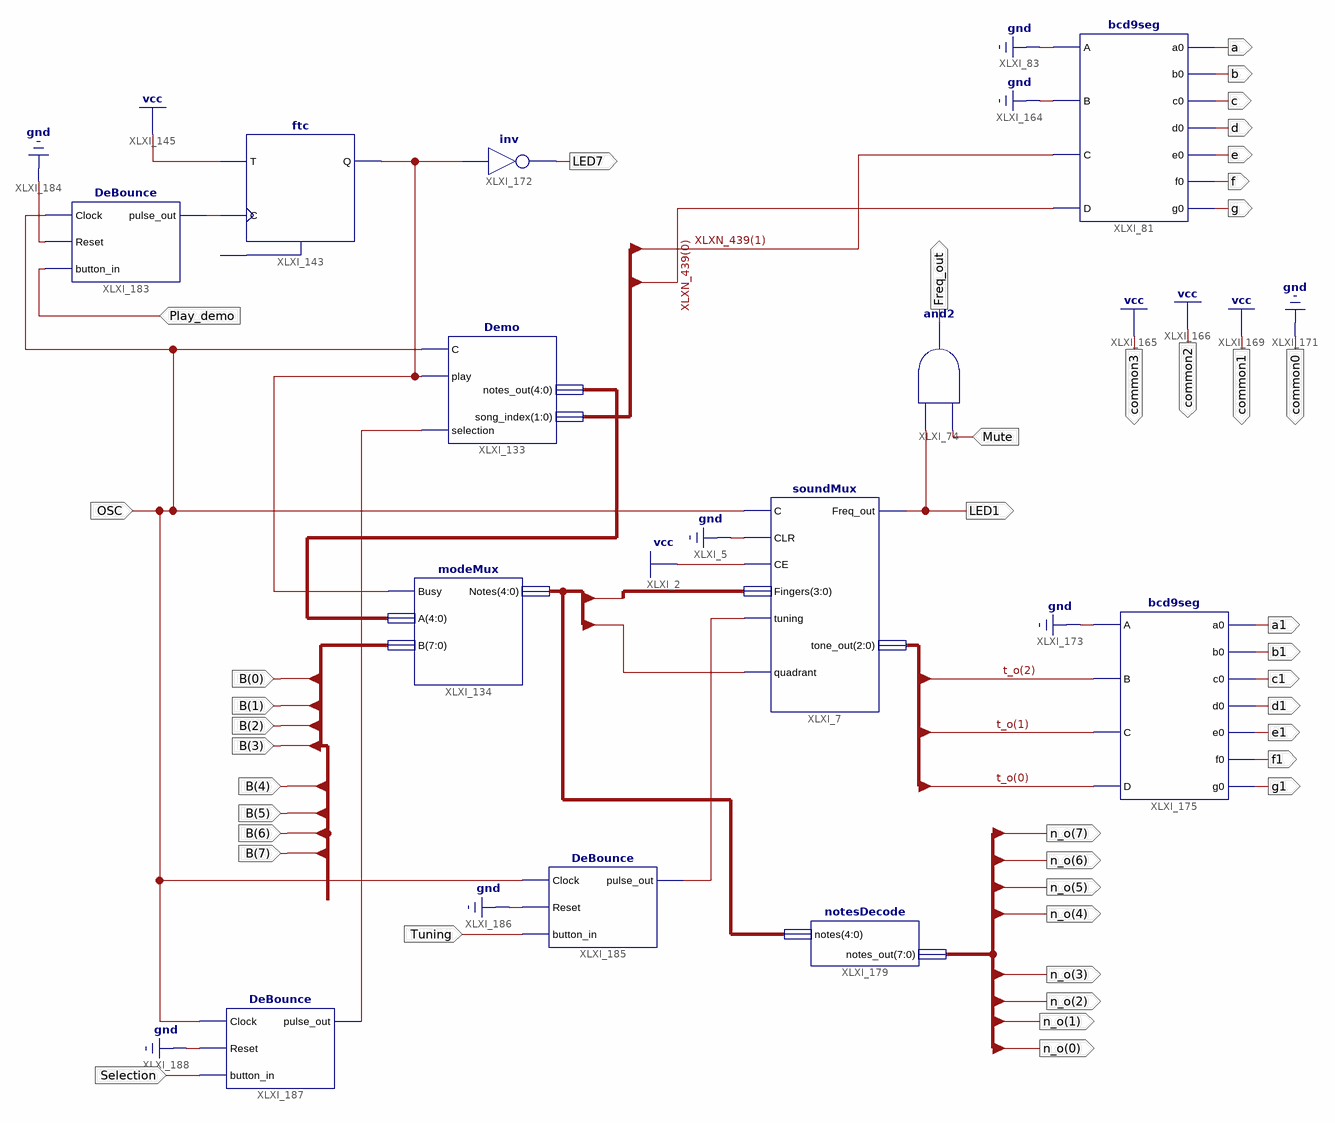
[diagram p0: schematic sheet 1]
// Xilinx ISE schematic main.sch (spartan6) as structural Verilog: 12 symbols, 42 ports
module main (
  input  OSC,
  input  Mute,
  input  [7:0] b,
  input  Play_demo,
  input  Tuning,
  input  Selection,
  output LED1,
  output Freq_out,
  output a,
  output b_1bit,
  output c,
  output d,
  output e,
  output f,
  output g,
  output common3,
  output common2,
  output common1,
  output common0,
  output LED7,
  output a1,
  output b1,
  output c1,
  output d1,
  output e1,
  output f1,
  output g1,
  output [7:0] n_o
);

  wire XLXN_431, XLXN_438, XLXN_619, XLXN_623;
  wire [1:0] XLXN_439;
  wire [2:0] t_o;
  wire [4:0] XLXN_427, XLXN_436;

  soundMux XLXI_7 (
    .C(OSC), .CLR(1'b0), .CE(1'b1), .tuning(XLXN_619), .quadrant(XLXN_436[4]), .Fingers(XLXN_436[3:0]),
    .Freq_out(LED1), .tone_out(t_o));
  Demo XLXI_133 (.C(OSC), .play(XLXN_438), .selection(XLXN_623), .notes_out(XLXN_427), .song_index(XLXN_439));
  modeMux XLXI_134 (.Busy(XLXN_438), .A(XLXN_427), .B(b), .Notes(XLXN_436));
  ftc XLXI_143 (.C(XLXN_431), .T(1'b1), .Q(XLXN_438));  // open: CLR
  and XLXI_74 (Freq_out, Mute, LED1);
  bcd9seg XLXI_81 (
    .A(1'b0), .B(1'b0), .C(XLXN_439[1]), .D(XLXN_439[0]), .a0(a), .b0(b_1bit), .c0(c), .d0(d), .e0(e),
    .f0(f), .g0(g));
  not XLXI_172 (LED7, XLXN_438);
  bcd9seg XLXI_175 (
    .A(1'b0), .B(t_o[2]), .C(t_o[1]), .D(t_o[0]), .a0(a1), .b0(b1), .c0(c1), .d0(d1), .e0(e1), .f0(f1),
    .g0(g1));
  notesDecode XLXI_179 (.notes(XLXN_436), .notes_out(n_o));
  DeBounce XLXI_183 (.Clock(OSC), .Reset(1'b0), .button_in(Play_demo), .pulse_out(XLXN_431));
  DeBounce XLXI_185 (.Clock(OSC), .Reset(1'b0), .button_in(Tuning), .pulse_out(XLXN_619));
  DeBounce XLXI_187 (.Clock(OSC), .Reset(1'b0), .button_in(Selection), .pulse_out(XLXN_623));

  assign common0 = 1'b0;
  assign common1 = 1'b1;
  assign common2 = 1'b1;
  assign common3 = 1'b1;
endmodule
